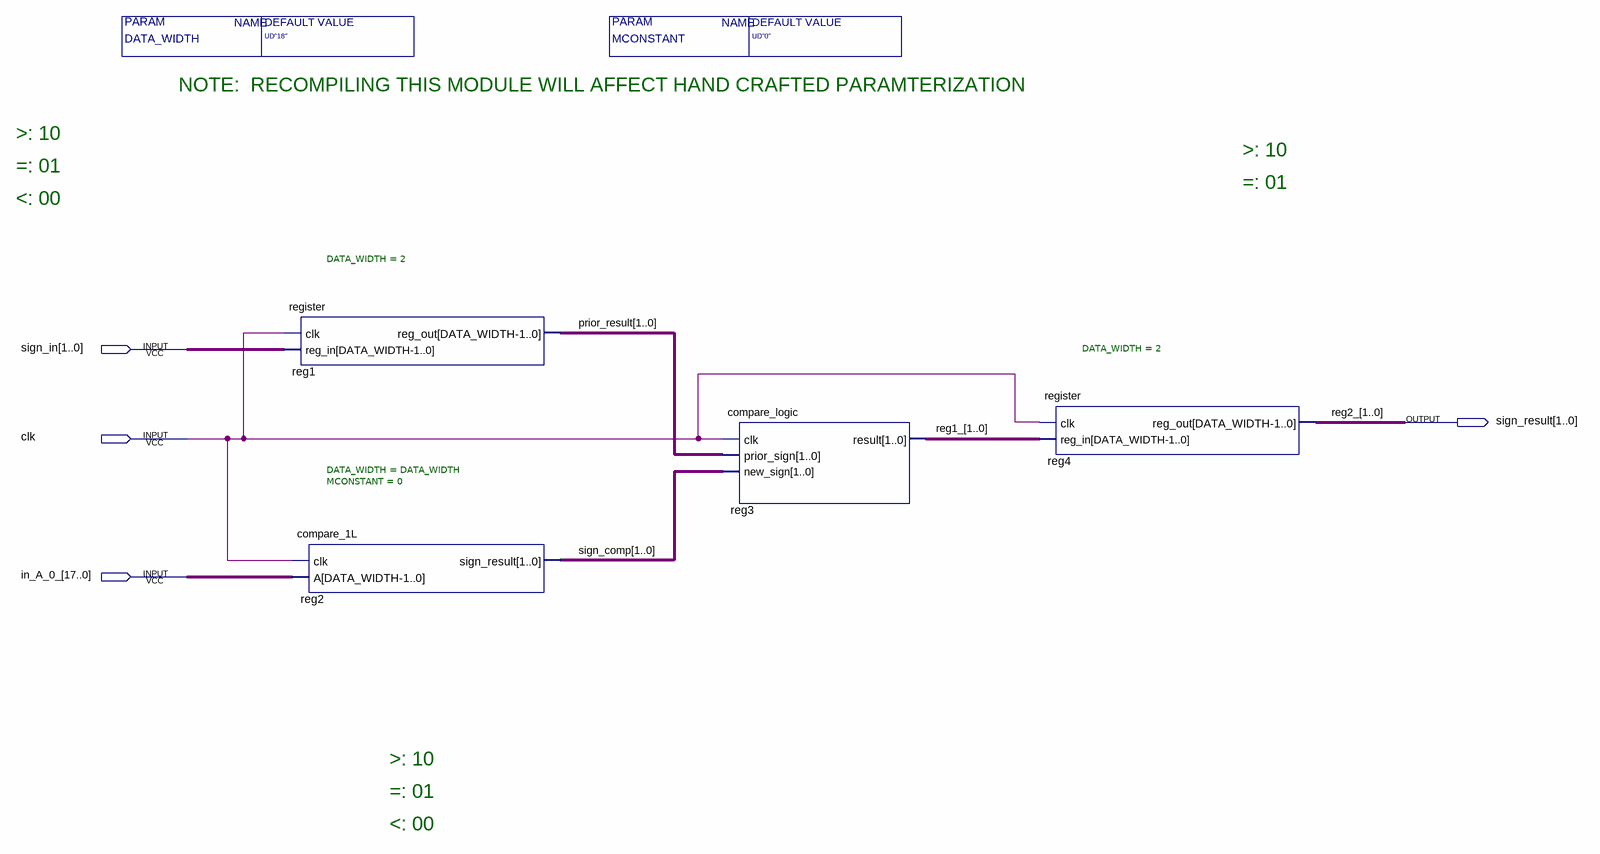
[diagram p0: schematic sheet]
// Quartus schematic ModCompare_3L_mlab.bdf as structural Verilog: 4 symbols, 4 pins
module ModCompare_3L_mlab #(parameter DATA_WIDTH = "UD\"18\"", parameter MCONSTANT = "UD\"0\"") (
  input  [1:0] sign_in,
  input  clk,
  input  [17:0] in_A_0_,
  output [1:0] sign_result
);

  wire [1:0] prior_result, reg1_, sign_comp;

  register #(.DATA_WIDTH(2)) reg1 (.clk(clk), .reg_in(sign_in), .reg_out(prior_result));
  compare_1L #(.DATA_WIDTH(DATA_WIDTH), .MCONSTANT(0)) reg2 (.clk(clk), .A(in_A_0_), .sign_result(sign_comp));
  compare_logic reg3 (.clk(clk), .prior_sign(prior_result), .new_sign(sign_comp), .result(reg1_));
  register #(.DATA_WIDTH(2)) reg4 (.clk(clk), .reg_in(reg1_), .reg_out(sign_result));

  // Other names for the same wires on the sheet: reg2_[1:0] = sign_result

  // Notes on the sheet:
  //   NOTE:  RECOMPILING THIS MODULE WILL AFFECT HAND CRAFTED PARAMTERIZATION
  //   >: 10
  //   >: 10
  //   =: 01
  //   =: 01
  //   <: 00
  //   >: 10
  //   =: 01
  //   <: 00
endmodule
